# EAGLE board VLR_ENCoMAT (EAGLE 7.2.0)
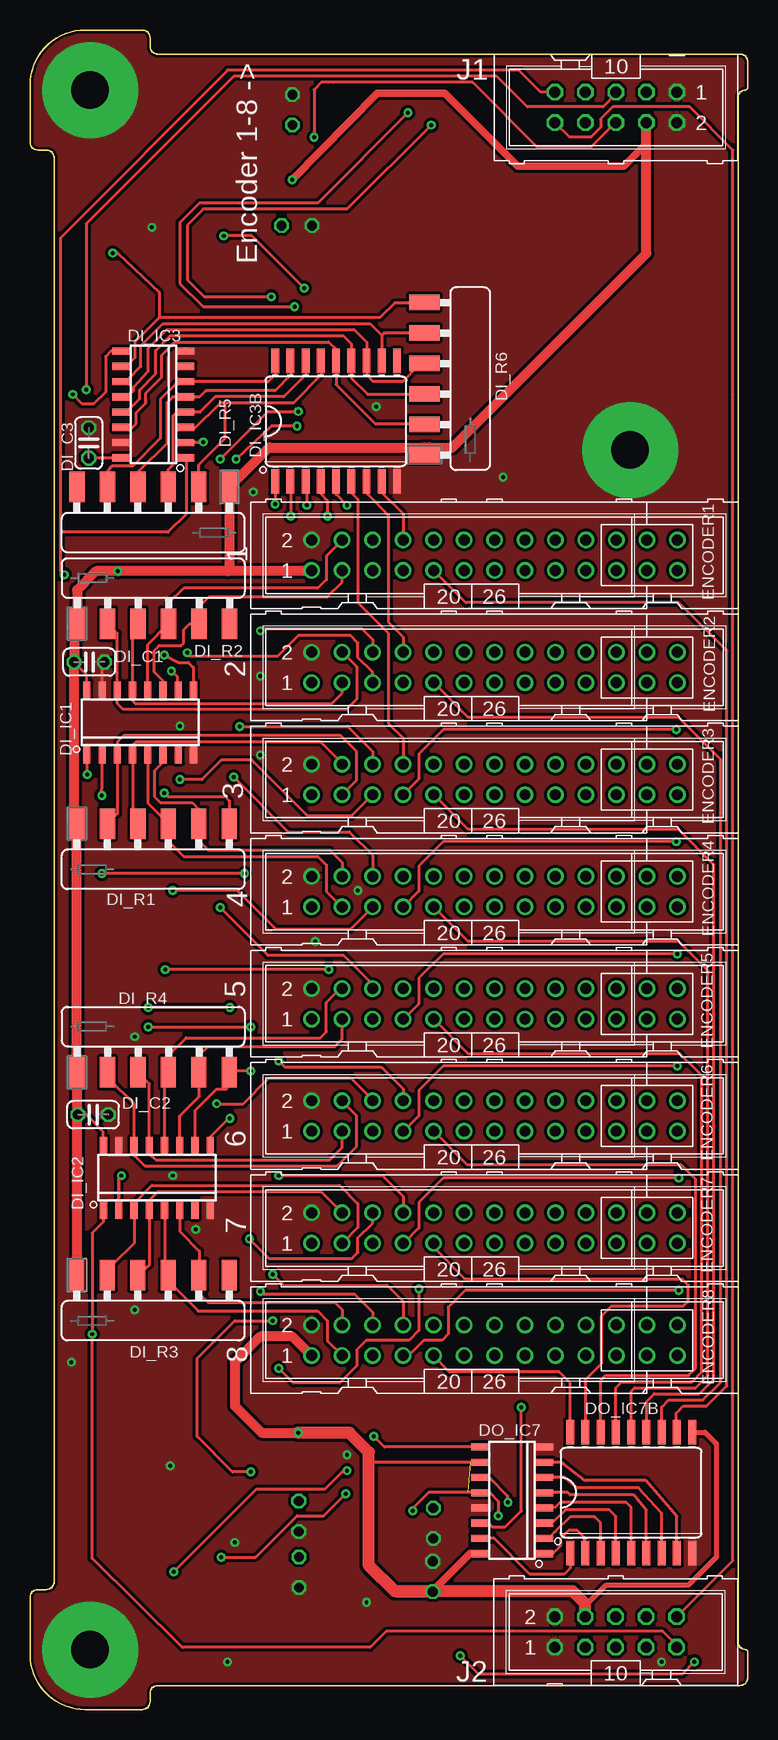
[diagram p2: board, top side]
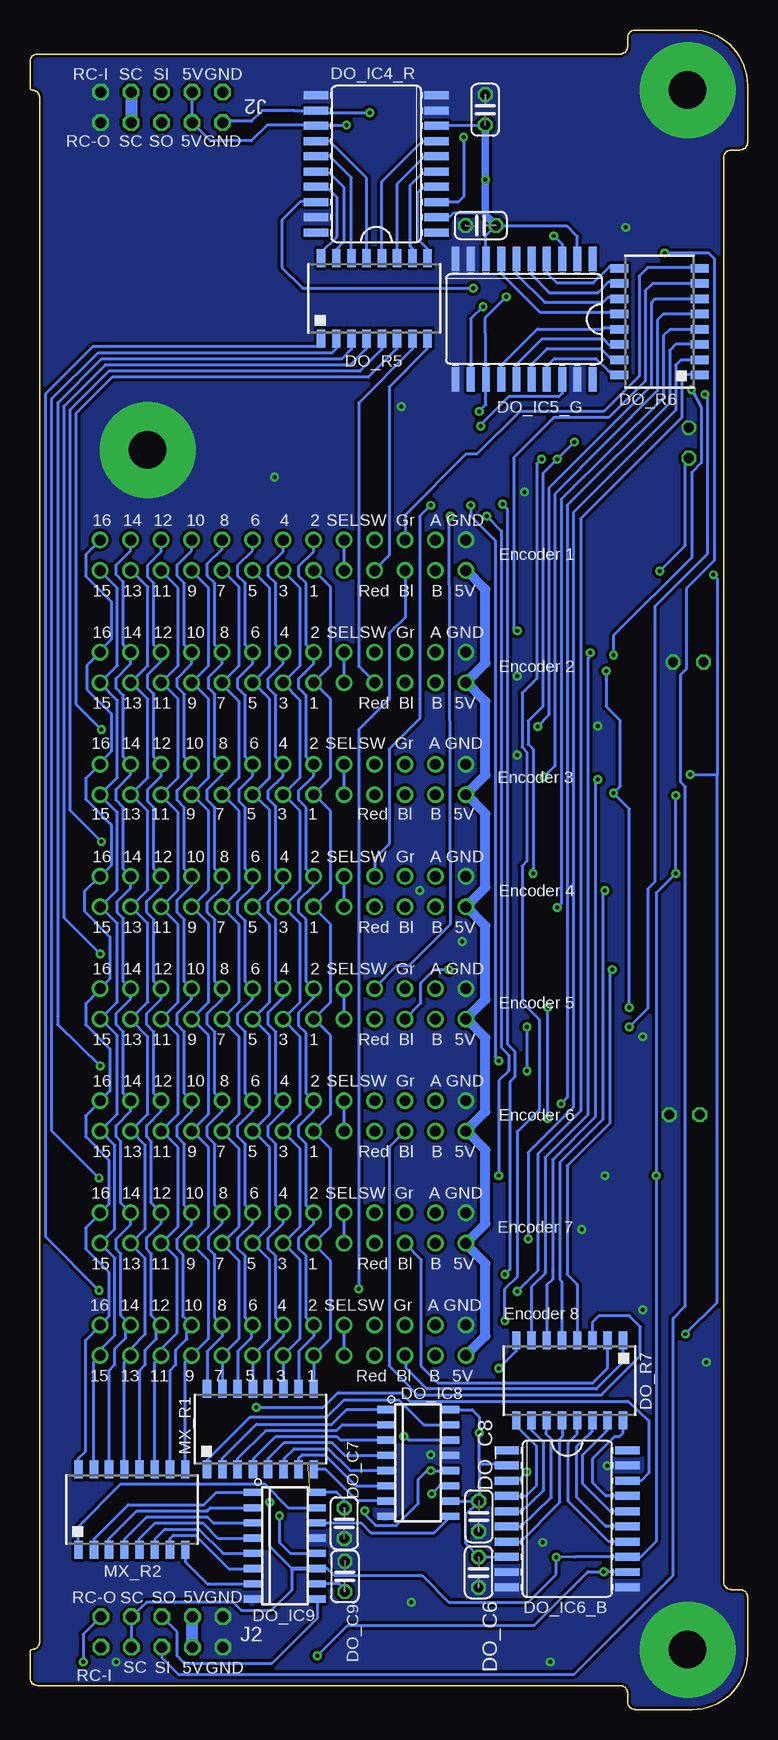
[diagram p3: board, bottom side, seen from below]

Size 59.8 x 140 mm. Coordinates in mm from the lower left corner, seen from the top.
Copper layers (1*16): Top 0.07mm / dielectric 1.6mm / Bottom 0.07mm
Design rules "001_MakePCB-8mil_min *": minimum track width 8mil, minimum drill 13mil, track to track 8mil, track to pad 8mil, pad to pad 8mil, via to via 8mil, smd to smd 8mil, copper to edge 8mil, drill to drill 8mil, minimum pad ring 8mil, minimum via ring 8mil, stop-mask expansion 2mil, vias tented up to drill 0mil, thermal gap 0mil
Net classes: 0 default: width 0.254 mm, drill 0.33 mm, clearance 0.254 mm; 1 VDD: width 0.406 mm, drill 0.33 mm, clearance 0.254 mm to class 0, clearance 0.254 mm

## Footprints (pad centres in the part's own frame; a part is rotated, then mirrored left to right if it is on the bottom)
C025-024X044 = drill 0.813 octagon: 1 -1.27,0; 2 1.27,0
SO16D = smd 0.6 x 1.4: 1 -4.481,-2.764; 2 -3.211,-2.764; 3 -1.941,-2.764; 4 -0.671,-2.764; 5 0.599,-2.764; 6 1.869,-2.764; 7 3.139,-2.764; 8 4.409,-2.764; 9 4.409,2.666; 10 3.139,2.666; 11 1.869,2.666; 12 0.599,2.666; 13 -0.671,2.666; 14 -1.941,2.666; 15 -3.211,2.666; 16 -4.481,2.666
SO18W = smd 0.66 x 2.032: 1 -5.08,-5.029; 2 -3.81,-5.029; 3 -2.54,-5.029; 4 -1.27,-5.029; 5 0,-5.029; 6 1.27,-5.029; 7 2.54,-5.029; 8 3.81,-5.029; 9 5.08,-5.029; 10 5.08,5.029; 11 3.81,5.029; 12 2.54,5.029; 13 1.27,5.029; 14 0,5.029; 15 -1.27,5.029; 16 -2.54,5.029; 17 -3.81,5.029; 18 -5.08,5.029
SIL6-SMD-R = smd 1.27 x 2.54: P$1 -6.35,0; P$2 -3.81,0; P$3 -1.27,0; P$4 1.27,0; P$5 3.81,0; P$6 6.35,0
SIL6-SMD = smd 1.27 x 2.54: P$1 -6.35,0; P$2 -3.81,0; P$3 -1.27,0; P$4 1.27,0; P$5 3.81,0; P$6 6.35,0
SO20W = smd 0.66 x 2.032: 1 -5.715,-5.029; 2 -4.445,-5.029; 3 -3.175,-5.029; 4 -1.905,-5.029; 5 -0.635,-5.029; 6 0.635,-5.029; 7 1.905,-5.029; 8 3.175,-5.029; 9 4.445,-5.029; 10 5.715,-5.029; 11 5.715,5.029; 12 4.445,5.029; 13 3.175,5.029; 14 1.905,5.029; 15 0.635,5.029; 16 -0.635,5.029; 17 -1.905,5.029; 18 -3.175,5.029; 19 -4.445,5.029; 20 -5.715,5.029
SOIC16W = smd 0.7 x 1.5: 1 -4.445,-3.346; 2 -3.175,-3.346; 3 -1.905,-3.346; 4 -0.635,-3.346; 5 0.635,-3.346; 6 1.905,-3.346; 7 3.175,-3.346; 8 4.445,-3.346; 9 4.445,3.346; 10 3.175,3.346; 11 1.905,3.346; 12 0.635,3.346; 13 -0.635,3.346; 14 -1.905,3.346; 15 -3.175,3.346; 16 -4.445,3.346
ML20-26COMBO = drill 0.914: 1 -15.24,-1.27; 2 -15.24,1.27; 3 -12.7,-1.27; 4 -12.7,1.27; 5 -10.16,-1.27; 6 -10.16,1.27; 7 -7.62,-1.27; 8 -7.62,1.27; 9 -5.08,-1.27; 10 -5.08,1.27; 11 -2.54,-1.27; 12 -2.54,1.27; 13 0,-1.27; 14 0,1.27; 15 2.54,-1.27; 16 2.54,1.27; 17 5.08,-1.27; 18 5.08,1.27; 19 7.62,-1.27; 20 7.62,1.27; 21 10.16,-1.27; 22 10.16,1.27; 23 12.7,-1.27; 24 12.7,1.27; 25 15.24,-1.27; 26 15.24,1.27
ML10 = drill 0.914 octagon: 1 -5.08,-1.27; 2 -5.08,1.27; 3 -2.54,-1.27; 4 -2.54,1.27; 5 0,-1.27; 6 0,1.27; 7 2.54,-1.27; 8 2.54,1.27; 9 5.08,-1.27; 10 5.08,1.27
MIDIBOX14X6 = drill 3.1 pad 8: P$1 5,135; P$2 50,105; P$4 5,5

## Placement (x,y rotation side)
DI_C1  100nF  [C025-024X044]  4.94,87.32 0 top
DI_C2  100nF  [C025-024X044]  5.26,49.58 0 top
DI_C3  100nF  [C025-024X044]  4.9,105.58 90 top
DI_IC1  74HC165N  [SO16D]  9.22,82.33 0 top
DI_IC2  74HC165N  [SO16D]  10.61,44.38 0 top
DI_IC3  74HC165N  [SO16D]  10.24,108.81 90 top
DI_IC3B  ULN2803  [SO18W]  25.5,107.39 0 top
DI_R1  10k  [SIL6-SMD-R]  10.26,73.84 180 top
DI_R2  10k  [SIL6-SMD]  10.27,90.51 0 top
DI_R3  10k  [SIL6-SMD-R]  10.26,36.22 180 top
DI_R4  10k  [SIL6-SMD]  10.26,53.12 0 top
DI_R5  10k  [SIL6-SMD]  10.26,101.91 180 top
DI_R6  10k  [SIL6-SMD-R]  32.87,110.94 270 top
DO_C4  100nF  [C025-024X044]  21.87,133.34 90 bottom
DO_C5  100nF  [C025-024X044]  22.24,123.7 180 bottom
DO_C6  100nF  [C025-024X044]  22.42,11.44 270 bottom
DO_C7  100n  [C025-024X044]  33.61,15.53 270 bottom
DO_C8  100n  [C025-024X044]  22.4,16.11 270 bottom
DO_C9  100n  [C025-024X044]  33.56,11.09 90 bottom
DO_IC4_R  TPIC6B595  [SO20W]  30.94,128.83 90 bottom
DO_IC5_G  TPIC6B595  [SO20W]  18.63,115.9 180 bottom
DO_IC6_B  TPIC6B595  [SO20W]  15.04,15.9 270 bottom
DO_IC7  74HC595  [SO16D]  40.13,17.48 90 top
DO_IC7B  ULN2803  [SO18W]  50.09,18.08 0 top
DO_IC8  74HC595  [SO16D]  27.41,20.52 270 bottom
DO_IC9  74HC595  [SO16D]  38.51,13.61 270 bottom
DO_R5  220  [SOIC16W]  31.11,117.63 0 bottom
DO_R6  220  [SOIC16W]  7.35,115.69 90 bottom
DO_R7  220  [SOIC16W]  14.83,27.43 180 bottom
ENCODER1  ML20-26COMBO  [ML20-26COMBO]  38.71,96.22 0 top
ENCODER2  ML20-26COMBO  [ML20-26COMBO]  38.71,86.87 0 top
ENCODER3  ML20-26COMBO  [ML20-26COMBO]  38.71,77.52 0 top
ENCODER4  ML20-26COMBO  [ML20-26COMBO]  38.71,68.17 0 top
ENCODER5  ML20-26COMBO  [ML20-26COMBO]  38.71,58.83 0 top
ENCODER6  ML20-26COMBO  [ML20-26COMBO]  38.71,49.48 0 top
ENCODER7  ML20-26COMBO  [ML20-26COMBO]  38.71,40.13 0 top
ENCODER8  ML20-26COMBO  [ML20-26COMBO]  38.71,30.78 0 top
J1  [ML10]  48.83,133.55 180 top
J2  [ML10]  48.81,6.46 0 top
MX_R1  220  [SOIC16W]  40.6,23.37 0 bottom
MX_R2  220  [SOIC16W]  51.31,16.66 0 bottom
U$2  MIDIBOX_HALF  [MIDIBOX14X6]  0,0 0 top
U$3  [ENCOMAT]  56.29,116.84 270 top
U$4  [VLRLAB]  40.44,127.51 270 top
U$5  [VLRLAB]  40.44,115.72 90 bottom

## Tracks (layer width: path | path; a pad name or v marks a point on that pad's centre or on a via)
+5V  (via drill 0.33)  (1 unrouted)
  Top 0.254: DO_IC7.10 37.46,20.62 36.68,20.62 28.24,20.62 | DI_IC1.16 4.74,86.25 DI_C1.1 | DI_IC3.16 4.87,104.33 DI_C3.1 | 36.79,12.99 DO_IC7.16 | DI_IC2.16 6.1,47.08 6.1,47.85 6.1,48.16 4.67,49.58 DI_C2.1
  Top 0.406: DO_IC7B.10 56.24,23.11 57.2,22.15 57.2,12.7 54.86,10.36 48,10.36 46.27,8.64
  Top 0.61: v21.84,127.51 28.96,134.72 34.54,134.72 40.64,128.63 49.48,128.63 51.37,130.51 J1.4 | 36.79,12.99 36.78,13.01 36.68,13.01 33.91,10.24 33.86,10.24 33.56,9.94 DO_C9.1
  Top 0.813: ENCODER1.1 23.47,94.89 16.46,94.89 | 16.46,94.89 v7.32,94.89 5.49,94.89 5.38,94.79 3.92,93.33 DI_R2.P$1 3.67,90.26 DI_C1.1 3.67,74.08 DI_R1.P$6 DI_R4.P$1 3.91,50.37 DI_C2.1 3.91,49.51 DI_R3.P$6 | ENCODER8.1 23.42,29.52 21.84,31.09 19.2,31.09 17.07,28.96 17.07,25.3 19.3,23.06 v22.35,23.06 | 16.46,94.89 16.61,95.05 DI_R5.P$1 19.9,105.2 | 19.9,105.2 32.87,105.21 DI_R6.P$6 32.91,104.55 32.92,104.85 33.27,105.21 35.2,105.21 | 19.9,105.2 20,105.21 35.2,105.21 | 35.2,105.21 51.37,121.37 J1.4
  Top 1.016: J2.4 46.27,8.64 46.27,8.8 45.21,9.86 30.38,9.86 | 30.38,9.86 28.24,11.99 28.24,20.62 28.24,21.44 26.62,23.06 v22.35,23.06 | 30.38,9.86 33.53,9.86 DO_C9.1
  Bottom 0.254: 4.9,104.32 5.18,103.83 5.18,97.03 v7.32,94.89 | DO_IC4_R.8 25.84,132.07 DO_C4.1 | DO_IC5_G.8 21.8,122.86 DO_C5.1 20.92,123.65 15.04,123.65 14.18,122.79 DO_IC5_G.2 | DO_IC4_R.2 25.84,124.46 24.79,124.46 24.49,124.77 21.87,124.77 | DO_IC8.10 23.67,17.37 23.37,17.37 DO_C8.1 | DO_C8.1 22.4,17.33 23.47,16.26 23.47,13.84 DO_C6.1 22.61,12.73 DO_IC6_B.8 | DO_IC6_B.2 20.14,20.42 | 20.14,20.42 22.35,20.42 | 22.35,20.42 22.35,18.49 22.36,17.78 DO_C8.1 | DO_C9.1 34.03,10.47 DO_IC9.10 | 36.47,18.09 DO_IC9.16 34.25,18.09 33.63,17.48 33.61,17.46 DO_C7.1 | 20.14,20.42 22.35,20.42 | 22.35,20.42 22.35,20.83 v22.35,23.06 22.35,24.38 22.96,24.99 23.98,24.99 DO_IC8.16
  Bottom 0.33: DI_C3.1 4.9,104.32
  Bottom 0.61: DO_C4.1 21.87,124.77 21.87,124.6 DO_C5.1 21.84,124.58 v21.84,127.51
  Bottom 0.813: ENCODER8.1 21.84,31.14 21.84,37.19 23.47,38.81 ENCODER7.1 21.84,40.49 21.84,46.63 23.42,48.21 ENCODER6.1 21.84,49.84 21.84,55.98 23.42,57.56 ENCODER5.1 21.84,59.18 21.84,65.33 23.42,66.9 ENCODER4.1 21.84,68.53 21.84,74.68 23.42,76.25 ENCODER3.1 21.84,77.88 21.84,84.02 23.42,85.6 ENCODER2.1 21.84,87.22 21.84,93.37 23.42,94.94 ENCODER1.1
  Bottom 1.016: J1.3 J1.4 | J2.3 J2.4
DI_IC3_SW1
  Top 0.254: DI_IC3.11 7.63,110.64 8.23,110.95 9.25,111.96 9.25,113.69 11.07,115.52 28.35,115.52 29.31,114.55 | 29.31,114.55 DI_IC3B.11 | DI_R6.P$2 29.51,114.75 29.31,114.55
DI_IC3_SW2
  Top 0.254: DI_IC3.12 8.33,109.63 8.61,109.91 8.61,110 8.64,110.25 9.86,111.57 9.86,113.49 11.38,115.01 27.03,115.01 28.04,113.99 DI_IC3B.12 28.04,111.25 28.55,110.74 31.09,110.74 32.31,111.96 32.62,111.96 DI_R6.P$3
DI_IC3_SW3
  Top 0.254: DI_IC3.13 7.77,108.1 8.18,108.31 9.14,109.27 9.14,109.98 10.46,111.35 10.46,113.28 11.68,114.5 26.11,114.5 26.77,113.84 DI_IC3B.13 26.77,111 28.14,109.63 32.83,109.63 DI_R6.P$4
DI_IC3_SW4
  Top 0.254: DI_IC3.14 8.52,106.87 8.84,107.19 8.84,108.1 9.65,108.92 9.65,109.12 9.65,109.73 10.97,111.05 10.97,111.25 10.97,112.88 11.79,113.69 12.09,114 24.89,114 25.5,113.39 DI_IC3B.14 25.5,110.44 28.75,107.19 32.81,107.19 DI_R6.P$5
DI_IC3_SW5
  Top 0.254: DI_IC3B.15 24.28,112.37 24.28,111.25 21.95,108.92 16.26,108.92 | 16.26,108.92 15.85,108.92 13.6,106.67 DI_IC3.3 | DI_R5.P$2 14.07,103.78 16.26,105.97 16.26,108.92
DI_IC3_SW6
  Top 0.254: DI_IC3B.16 22.96,111.25 21.13,109.42 15.44,109.42 14.16,108.14 DI_IC3.4 12.23,108.14 11.89,107.8 11.89,103.73 11.48,103.33 11.48,101.86 DI_R5.P$3
DI_IC3_SW7
  Top 0.254: DI_IC3B.17 21.74,112.37 21.74,111.25 20.42,109.93 14.73,109.93 14.63,109.93 14.11,109.41 DI_IC3.5 11.88,109.41 11.38,108.92 11.38,105.51 9.04,103.23 9.04,101.96 DI_R5.P$4
DI_IC3_SW8
  Top 0.254: DI_IC3B.18 20.42,111.25 19.85,110.68 DI_IC3.6 12.13,110.48 10.87,109.22 10.87,105.97 8.55,103.64 6.82,103.64 6.4,103.12 6.4,102.16 DI_R5.P$5
DI_IC4_SER_OUT2  (via drill 0.33)
  Top 0.254: DI_IC1.10 12.29,86.05 v11.79,86.56 | v11.18,76.4 11.48,76.1 16.26,76.1 16.61,75.74 DI_R1.P$1 | DI_IC2.9 15.02,47.74 16.36,49.07 v16.66,49.28 | v16.66,58.52 v9.86,58.52
  Bottom 0.254: v11.79,86.56 11.79,85.85 11.79,83.62 10.67,82.5 10.67,76.91 v11.18,76.4 9.86,75.08 v9.86,58.52 | v16.66,49.28 v16.66,58.52
DI_IC5_SER_OUT2  (via drill 0.33)
  Top 0.254: DI_IC2.10 13.75,49.92 15.54,51.71 16.36,51.71 16.66,52.02 16.66,53.06 DI_R4.P$6 16.73,53.24 v18.39,53.24 | DI_IC3.9 6.75,113.22 6.3,112.78 6.3,109.83 5.28,108.81 4.37,108.81 v3.56,109.63 | v9.86,56.9 v18.39,56.9
  Bottom 0.254: v3.56,109.63 3.56,109.53 3.35,109.32 3.35,96.32 6.6,93.07 7.72,91.95 7.72,68.99 8.33,68.38 8.33,58.42 v9.86,56.9 | v18.39,56.9 v18.39,53.24
DO_IC4_R_QA
  Bottom 0.254: DO_R5.9 26.66,121.74 27.5,122.58 27.5,126.44 27.1,126.85 25.99,126.85 DO_IC4_R.4
DO_IC4_R_QB
  Bottom 0.254: DO_R5.10 27.93,121.79 28.11,121.97 28.11,127.05 27.1,128.07 26.04,128.07 DO_IC4_R.5
DO_IC4_R_QC
  Bottom 0.254: DO_R5.11 29.2,127.18 26.89,129.49 25.93,129.49 DO_IC4_R.6
DO_IC4_R_QD
  Bottom 0.254: DO_R5.12 30.47,127.33 27.1,130.71 25.94,130.71 DO_IC4_R.7
DO_IC4_R_QE
  Bottom 0.254: DO_R5.13 31.74,127.63 34.82,130.71 35.94,130.71 DO_IC4_R.14
DO_IC4_R_QF
  Bottom 0.254: DO_R5.14 33.01,127.68 34.82,129.49 35.95,129.49 DO_IC4_R.15
DO_IC4_R_QG
  Bottom 0.254: DO_R5.15 34.28,121.69 33.6,122.38 33.6,126.85 34.82,128.07 35.84,128.07 DO_IC4_R.16
DO_IC4_R_QH
  Bottom 0.254: DO_R5.16 35.55,121.44 34.21,122.78 34.21,126.03 35.02,126.85 35.89,126.85 DO_IC4_R.17
DO_IC4_R_SEROUT  (via drill 0.33)
  Top 0.254: v22.86,118.47 18.49,122.83 v16.15,122.83
  Bottom 0.254: DO_IC4_R.18 35.99,125.68 37.29,125.68 38.81,124.16 38.81,120.19 37.08,118.47 v22.86,118.47 | v16.15,122.83 15.45,122.13 DO_IC5_G.3
DO_IC5_G_QA
  Bottom 0.254: DO_IC5_G.4 16.72,119.75 15.9,118.92 12.85,118.92 11.5,120.28 10.96,120.28 DO_R6.9
DO_IC5_G_QB
  Bottom 0.254: DO_IC5_G.5 17.99,119.59 16.51,118.11 12.45,118.11 11.55,119 10.76,119 DO_R6.10
DO_IC5_G_QC
  Bottom 0.254: DO_IC5_G.6 19.26,119.64 16.92,117.3 12.04,117.3 11.6,117.73 10.96,117.73 DO_R6.11
DO_IC5_G_QD
  Bottom 0.254: DO_IC5_G.7 20.53,119.69 17.32,116.49 11.08,116.49 11.1,116.31 DO_R6.12
DO_IC5_G_QE
  Bottom 0.254: DO_IC5_G.14 20.53,112.06 17.53,115.06 12.04,115.06 11.91,115.19 10.76,115.19 DO_R6.13
DO_IC5_G_QF
  Bottom 0.254: DO_IC5_G.15 19.26,112.11 17.12,114.25 12.04,114.25 | 11.82,114.03 11.57,113.78 DO_R6.14 | 11.82,114.03 12.04,114.25 | 11.82,114.03 12.04,114.25
DO_IC5_G_QG
  Bottom 0.254: DO_IC5_G.16 17.99,112.16 16.71,113.44 12.24,113.44 | 11.56,112.76 11.32,112.51 DO_R6.15 | 11.56,112.76 12.24,113.44 | 11.56,112.76 12.24,113.44
DO_IC5_G_QH
  Bottom 0.254: DO_IC5_G.17 16.71,111.08 16.71,112.02 16.1,112.62 12.65,112.62 11.63,111.61 | DO_R6.16 11.27,111.24 11.61,111.59 11.63,111.61 | 11.63,111.61
DO_IC5_G_SEROUT  (via drill 0.33)
  Top 0.254: v22.25,106.98 20.12,106.98 v17.17,104.24 | v18.39,19.81 16.87,19.81 13.92,22.76 13.92,29.26 17.07,32.41 v20.22,32.41
  Bottom 0.254: DO_IC5_G.18 15.44,110.86 15.44,109.73 15.75,109.42 19.91,109.42 22.25,107.09 v22.25,106.98 | DO_IC6_B.3 20.04,19.1 19.1,19.1 v18.39,19.81 | v17.17,104.24 17.58,103.83 17.58,85.95 18.8,84.73 18.8,80.21 18.39,79.81 18.39,70.71 18.8,70.31 18.8,58.93 17.37,57.51 17.37,49.99 19.2,48.16 19.2,36.07 20.22,35.05 v20.22,32.41
DO_IC6_B_QA
  Bottom 0.254: DO_IC6_B.4 18.47,17.81 17.58,18.69 17.58,21.95 19.31,23.67 19.31,23.55 19.28,23.58 DO_R7.9
DO_IC6_B_QB
  Bottom 0.254: DO_IC6_B.5 18.82,16.54 16.97,18.29 16.97,22.25 18.03,23.32 18.03,23.35 18.01,23.57 DO_R7.10
DO_IC6_B_QC
  Bottom 0.254: DO_IC6_B.6 18.87,15.27 16.36,17.68 16.36,22.55 16.77,22.94 16.74,23.47 DO_R7.11
DO_IC6_B_QD
  Bottom 0.254: DO_IC6_B.7 18.92,14 15.65,17.27 15.65,22.53 15.39,22.87 15.4,23.07 15.37,23.51 DO_R7.12
DO_IC6_B_QE
  Bottom 0.254: DO_IC6_B.14 11.56,14 14.94,17.37 14.94,22.23 14.85,22.33 14.33,22.84 14.2,22.97 DO_R7.13
DO_IC6_B_QF
  Bottom 0.254: DO_IC6_B.15 11.81,15.27 14.23,17.68 14.23,21.95 13.62,22.55 13.21,22.94 12.93,23.22 DO_R7.14
DO_IC6_B_QG
  Bottom 0.254: DO_IC6_B.16 11.46,16.54 13.72,18.8 13.72,21.23 12.19,22.76 11.79,23.19 11.66,23.32 DO_R7.15
DO_IC6_B_QH
  Bottom 0.254: DO_IC6_B.17 11.81,17.81 12.9,18.9 12.9,20.93 11.07,22.76 10.67,22.76 10.36,23.06 10.36,24.06 DO_R7.16
DO_IC6_B_SEROUT  (via drill 0.33)
  Top 0.254: DO_IC7.14 37.48,15.54 38.2,15.54 38.51,15.24 39.62,15.24 40.94,16.56 v40.94,25.2
  Bottom 0.254: v40.94,25.2 40.84,25.2 35.36,25.2 34.14,26.42 28.85,26.42 28.14,25.7 9.96,25.7 8.23,24.08 8.23,19.71 8.86,19.08 DO_IC6_B.18
DO_IC7_QA
  Top 0.254: DO_IC7B.1 45.01,11.79 44.5,11.28 44.45,11.28 41.66,11.28 38.67,14.26 DO_IC7.15
DO_IC7_QB
  Top 0.254: DO_IC7B.2 46.23,13.11 46.23,14.33 45.62,14.94 44.91,14.94 44.2,14.22 44.2,14.02 44.2,13.61 43.58,12.99 DO_IC7.1
DO_IC7_QC
  Top 0.254: DO_IC7B.3 47.55,15.54 47.04,16.05 45.01,16.05 43.79,14.83 43.22,14.26 DO_IC7.2
DO_IC7_QD
  Top 0.254: DO_IC7B.4 48.82,16.1 48.26,16.66 44.63,16.66 43.59,15.65 43.01,15.65 DO_IC7.3
DO_IC7_QE
  Top 0.254: DO_IC7B.5 50.09,16.87 49.68,17.27 44.2,17.27 43.79,16.87 42.84,16.8 DO_IC7.4
DO_IC7_QF
  Top 0.254: DO_IC7B.6 51.36,16.61 50.29,17.88 45.01,17.88 44.81,18.09 43.11,18.09 DO_IC7.5
DO_IC7_QG
  Top 0.254: DO_IC7B.7 52.63,16.36 50.7,18.49 45.62,18.49 44.6,19.3 44.56,19.34 DO_IC7.6
DO_IC7_QH
  Top 0.254: DO_IC7B.8 53.9,16.1 51.31,19.1 46.23,19.1 44.4,20.52 44.31,20.61 DO_IC7.7
DO_IC7_SEROUT  (via drill 0.33)
  Top 0.254: DO_IC7.9 29.53,21.88 v28.65,22.76
  Bottom 0.254: v28.65,22.76 28.25,22.46 DO_IC8.14
DO_IC8_ROW1
  Bottom 0.254: DO_IC8.7 32.52,17.38 35.15,20.02 MX_R1.8
DO_IC8_ROW2
  Bottom 0.254: MX_R1.7 37.42,20.9 37.39,20.93 37.08,21.23 35.26,21.23 32.67,18.65 DO_IC8.6
DO_IC8_ROW3
  Bottom 0.254: MX_R1.6 38.61,20.11 38.61,20.93 37.8,21.74 35.05,21.74 34.95,21.74 33.13,19.92 DO_IC8.5
DO_IC8_ROW4
  Bottom 0.254: MX_R1.5 39.93,20.05 39.93,20.93 38.61,22.25 34.65,22.25 33.59,21.19 DO_IC8.4
DO_IC8_ROW5
  Bottom 0.254: MX_R1.4 41.15,20.11 41.15,20.93 39.32,22.76 34.24,22.76 33.94,22.46 DO_IC8.3
DO_IC8_ROW6
  Bottom 0.254: MX_R1.3 42.47,20.05 42.47,20.93 40.13,23.27 34.24,23.27 33.77,23.73 DO_IC8.2
DO_IC8_ROW7
  Bottom 0.254: MX_R1.2 43.79,20.04 43.79,20.93 40.94,23.77 34.65,23.77 33.42,25 DO_IC8.1
DO_IC8_ROW8
  Bottom 0.254: MX_R1.1 45.01,20.05 45.01,20.83 41.45,24.38 35.05,24.38 33.63,25.81 29.06,25.81 26.98,23.73 DO_IC8.15
DO_IC8_SEROUT
  Bottom 0.254: DO_IC9.14 35.83,15.54 32.21,15.54 31.39,14.73 26.11,14.73 24.75,16.1 DO_IC8.9
DO_IC9_ROW1
  Bottom 0.254: MX_R2.8 46.86,12.32 45.01,10.46 42.78,10.47 42.77,10.46 DO_IC9.7
DO_IC9_ROW2
  Bottom 0.254: MX_R2.7 48.13,14.2 48.16,14.22 47.85,14.53 46.02,14.53 43.24,11.74 DO_IC9.6
DO_IC9_ROW3
  Bottom 0.254: MX_R2.6 49.38,13.34 49.38,14.22 48.56,15.04 45.72,15.04 43.7,13.01 DO_IC9.5
DO_IC9_ROW4
  Bottom 0.254: MX_R2.5 50.7,13.34 50.7,14.22 49.38,15.54 45.42,15.54 44.15,14.28 DO_IC9.4
DO_IC9_ROW5
  Bottom 0.254: MX_R2.4 51.92,13.34 51.92,14.22 50.09,16.05 45.01,16.05 44.51,15.55 DO_IC9.3
DO_IC9_ROW6
  Bottom 0.254: MX_R2.3 53.24,13.34 53.24,14.22 50.9,16.56 45.01,16.56 44.75,16.82 DO_IC9.2
DO_IC9_ROW7
  Bottom 0.254: MX_R2.2 54.46,13.34 54.46,14.22 51.61,17.07 45.31,17.07 44.29,18.09 DO_IC9.1
DO_IC9_ROW8
  Bottom 0.254: MX_R2.1 55.78,13.34 55.78,15.24 52.22,18.8 40.23,18.8 38.26,16.82 DO_IC9.15
GND  (via drill 0.33)
  Top 0.254: DI_IC1.15 6.01,86.93 DI_C1.2
  other vias: 52.63,3.96 26.42,21.23 11.68,20.32 16.46,3.96 28.04,8.94 17.07,13.92 3.45,28.96 8.74,33.32 8.74,56.08 11.89,44.5 13.82,40.03 27.33,68.28 23.77,64.01 12.5,81.99 19.2,86.16 19.2,79.55 28.85,108.61 18.59,101.5 39.42,102.72 10.16,123.55
  pour Bottom: 64.62,-2.95 -3.05,-2.95 -3.05,140.41 64.62,140.41
  pour Top: 64.11,-2.44 -3.56,-2.44 -4.06,140.72 64.11,140.92
MATRIXROT1
  Top 0.254: DO_IC7B.11 53.85,23.17 53.85,24.69 54.46,25.3 56.39,25.3 58.06,26.98 58.06,35.23 58.06,88.24 57.96,88.34 54.05,92.25 36.32,92.25 ENCODER1.9
  Bottom 0.254: ENCODER1.9 ENCODER1.10
MATRIXROT2
  Top 0.254: DO_IC7B.12 52.63,25.2 53.24,25.81 56.08,25.81 57.56,27.28 57.56,35.26 57.56,79.2 54.23,82.53 | ENCODER2.9 36.53,82.7 54.05,82.7 54.23,82.53 | 57.45,79.3 54.23,82.53
  Bottom 0.254: ENCODER2.9 ENCODER2.10
MATRIXROT3
  Top 0.254: DO_IC7B.13 51.41,23.16 51.41,25.7 52.02,26.31 55.68,26.31 55.78,26.31 57,27.53 57,35.15 57,70.41 54.05,73.36 36.53,73.36 ENCODER3.9
  Bottom 0.254: ENCODER3.9 ENCODER3.10
MATRIXROT4
  Top 0.254: DO_IC7B.14 50.09,26.52 50.39,26.82 55.47,26.82 56.49,27.84 56.49,35.26 56.49,61.57 | ENCODER4.9 36.53,64.01 54.05,64.01 56.39,61.67 | 56.49,61.57 56.39,61.67 | 56.49,61.57 56.39,61.67
  Bottom 0.254: ENCODER4.9 ENCODER4.10
MATRIXROT5
  Top 0.254: DO_IC7B.15 48.82,26.82 49.33,27.33 55.07,27.33 55.17,27.33 55.98,28.14 55.98,35.15 55.98,52.83 | ENCODER5.9 36.53,54.66 54.15,54.66 55.63,53.19 | 55.98,52.83 55.63,53.19 | 55.98,52.83 55.63,53.19
  Bottom 0.254: ENCODER5.9 ENCODER5.10
MATRIXROT6
  Top 0.254: DO_IC7B.16 47.55,27.43 47.96,27.84 54.86,27.84 55.47,28.45 55.47,35.2 55.47,44.2 54.25,45.41 36.42,45.41 ENCODER6.9
  Bottom 0.254: ENCODER6.9 ENCODER6.10
MATRIXROT7
  Top 0.254: DO_IC7B.17 46.33,23.16 46.33,24.08 46.33,27.53 47.14,28.35 47.65,28.85 47.65,32.72 47.65,32.82 48.46,33.63 54.46,33.63 54.86,34.04 54.86,35.36 54.36,35.87 36.27,35.87 33.63,38.51 ENCODER7.9
  Bottom 0.254: ENCODER7.9 ENCODER7.10
MATRIXROT8
  Top 0.254: DO_IC7B.18 45.01,24.08 45.01,27.23 44.09,28.14 34.95,28.14 33.63,29.46 ENCODER8.9
  Bottom 0.254: ENCODER8.9 ENCODER8.10
R1B  (via drill 0.33)
  Top 0.254: v32.41,35.05 32.41,31.6 31.6,30.79 28.04,30.79 27.23,29.97 27.23,28.65 25.81,27.23 21.95,27.23 v20.73,28.45
  Bottom 0.254: ENCODER1.5 28.55,91.03 29.87,89.71 29.87,84.23 32.41,81.69 v32.41,35.05 | v20.73,28.45 19.28,29.9 DO_R7.8
R1G
  Bottom 0.254: DO_R6.8 4.06,120.19 8.33,120.19 9.04,119.48 9.04,111.15 11.99,108.2 19,108.2 22.56,104.65 23.47,104.65 28.55,99.57 ENCODER1.6
R1R
  Bottom 0.254: DO_R5.8 26.72,114.23 26.72,113.39 29.87,110.24 29.87,96.22 31.09,95 ENCODER1.7
R2B  (via drill 0.33)
  Top 0.254: ENCODER2.5 28.55,86.46 27.33,87.68 27.33,88.9 26.72,89.51 22.35,89.51 20.62,87.78 13.41,87.78 v13.11,88.09
  Bottom 0.254: v13.11,88.09 13.31,87.58 13.31,49.78 13.31,49.58 16.87,46.02 16.87,36.58 16.87,36.47 16.87,36.37 18.01,35.23 DO_R7.7
R2G  (via drill 0.33)
  Top 0.254: v19.2,89.92 19.51,90.12 27.64,90.12 28.55,89.2 ENCODER2.6
  Bottom 0.254: DO_R6.7 4.01,118.87 7.92,118.87 8.53,118.26 8.53,110.74 11.58,107.7 16.15,107.7 19.51,104.34 19.51,90.12 v19.2,89.92
R2R
  Bottom 0.254: DO_R5.7 27.94,113.39 32.41,108.92 32.41,86.97 31.09,85.65 ENCODER2.7
R3B  (via drill 0.33)
  Top 0.254: ENCODER3.5 26.77,74.47 23.16,74.47 18.49,79.15 15.95,79.15 14.33,77.52 v12.5,77.52
  Bottom 0.254: v12.5,77.52 12.7,77.72 12.7,49.38 16.26,45.82 16.26,36.58 16.26,35.87 16.74,35.38 DO_R7.6
R3G  (via drill 0.33)
  Top 0.254: v17.48,81.94 26.47,81.94 28.55,79.86 ENCODER3.6
  Bottom 0.254: DO_R6.6 4.04,117.55 7.72,117.55 8.03,117.25 8.03,110.34 16.56,101.8 16.56,82.91 v17.48,81.94
R3R  (via drill 0.33)
  Top 0.254: 31.14,76.25 ENCODER3.7 32.41,77.57 32.41,79.65 34.44,81.69 v53.85,81.69
  Bottom 0.254: DO_R5.6 29.26,114.23 29.26,113.39 31.6,111.05 52.93,111.05 55.98,108 55.98,83.82 v53.85,81.69
R4B  (via drill 0.33)
  Top 0.254: ENCODER4.5 26.67,65.02 20.52,65.02 17.27,68.28 v11.89,68.28
  Bottom 0.254: v11.89,68.28 12.09,68.38 12.09,49.17 15.65,45.62 15.65,36.58 15.65,35.87 15.47,35.69 DO_R7.5
R4G  (via drill 0.33)
  Top 0.254: v16.97,77.72 21.54,73.15 26.62,73.15 28.55,71.22 ENCODER4.6
  Bottom 0.254: DO_R6.5 4.01,116.33 7.01,116.33 7.52,115.82 7.52,109.93 16.05,101.3 16.05,78.64 v16.97,77.72
R4R  (via drill 0.33)
  Top 0.254: v53.85,72.34 34.44,72.34 32.41,70.31 32.41,68.22 ENCODER4.7
  Bottom 0.254: DO_R5.5 30.47,113.39 30.48,113.39 32.31,111.56 53.24,111.56 56.49,108.31 56.49,74.98 v53.85,72.34
R5B  (via drill 0.33)
  Top 0.254: v24.89,61.67 v11.28,61.67
  Bottom 0.254: ENCODER5.5 27.23,58.88 27.23,60.55 26.11,61.67 v24.89,61.67 | v11.28,61.67 11.48,61.47 11.48,48.87 15.04,45.31 15.04,36.27 14.2,35.43 DO_R7.4
R5G  (via drill 0.33)
  Top 0.254: v15.85,66.85 19.81,62.89 26.11,62.89 28.55,60.45 ENCODER5.6
  Bottom 0.254: DO_R6.4 4.04,115.01 6.5,115.01 7.01,114.5 7.01,109.32 15.54,100.89 15.54,67.16 v15.85,66.85
R5R  (via drill 0.33)
  Top 0.254: v53.95,62.99 53.75,62.99 34.44,62.99 32.41,60.96 32.41,58.83 31.14,57.56 ENCODER5.7
  Bottom 0.254: DO_R5.4 31.74,113.44 31.8,113.39 33.12,112.06 53.54,112.06 57,108.61 57,66.04 v53.95,62.99
R6B
  Bottom 0.254: ENCODER6.5 29.87,46.89 29.87,28.65 27.53,26.21 12.19,26.21 8.94,29.46 8.94,31.9 9.86,32.82 12.4,32.82 12.93,32.28 DO_R7.3
R6G  (via drill 0.33)
  Top 0.254: v15.54,50.49 17.78,50.49 19.91,52.63 26.72,52.63 28.55,50.8 ENCODER6.6
  Bottom 0.254: DO_R6.3 4.01,113.79 5.99,113.79 6.5,113.28 6.5,108.92 15.04,100.38 15.04,51 v15.54,50.49
R6R  (via drill 0.33)
  Top 0.254: v53.95,53.65 53.64,53.65 34.44,53.65 32.41,51.61 32.41,49.48 31.14,48.21 ENCODER6.7
  Bottom 0.254: DO_R5.3 33.01,113.39 33.02,113.39 33.83,112.57 53.85,112.57 57.51,108.92 57.51,57.81 57.51,57.1 v53.95,53.65
R7B
  Bottom 0.254: ENCODER7.5 27.23,37.54 27.23,28.65 25.81,27.23 12.9,27.23 11.66,28.47 DO_R7.2
R7G  (via drill 0.33)
  Top 0.254: v18.29,39.22 19.91,37.59 26.82,37.59 27.33,38.1 27.33,39.32 28.55,40.54 ENCODER7.6
  Bottom 0.254: DO_R6.2 4.04,112.47 5.59,112.47 5.99,112.06 5.99,108.31 14.53,99.77 14.53,50.19 18.29,46.43 v18.29,39.22
R7R  (via drill 0.33)
  Top 0.254: v54.05,44.3 34.44,44.3 32.41,42.27 32.41,40.13 31.14,38.86 ENCODER7.7
  Bottom 0.254: DO_R5.2 34.28,113.44 34.34,113.39 34.65,113.08 54.15,113.08 58.01,109.22 58.01,48.26 v54.05,44.3
R8B
  Bottom 0.254: DO_R7.1 10.39,28.93 12.6,26.72 26.72,26.72 28.45,28.45 28.45,29.41 ENCODER8.5
R8G  (via drill 0.33)
  Top 0.254: v19.2,34.85 19.41,34.65 27.03,34.65 28.55,33.12 ENCODER8.6
  Bottom 0.254: DO_R6.1 4.01,111.25 5.18,111.25 5.38,111.05 5.49,110.95 5.49,107.7 13.92,99.26 13.92,49.89 17.48,46.33 17.48,38.41 17.48,36.58 v19.2,34.85
R8R  (via drill 0.33)
  Top 0.254: v54.05,34.95 36.27,34.95 34.85,33.53 34.85,31.29 34.34,30.79 32.82,30.79 31.55,29.52 ENCODER8.7
  Bottom 0.254: DO_R5.1 35.54,113.59 54.56,113.59 58.52,109.63 58.52,39.42 v54.05,34.95
RC-I  (via drill 0.33)
  Top 0.254: DI_IC1.1 4.74,78.06 v4.78,77.93 | 2.54,98.15 2.54,122.63 16.46,136.65 40.74,136.65 42.57,134.82 J1.9 | DI_IC3.1 13,99.67 11.48,98.15 2.54,98.15 | 6.1,41.65 DI_IC2.1 6.1,41.58 6.1,40.64 5.18,39.73 v5.18,31.29 5.18,12.6 12.7,5.18 28.35,5.18 29.67,6.5 52.73,6.5 53.89,5.34 J2.9 | 2.54,98.15 2.54,94.89 v2.84,94.59
  Bottom 0.254: v2.84,94.59 2.54,94.28 2.54,77.93 | v4.78,77.93 2.54,77.93 | v5.18,31.29 2.54,33.93 2.54,77.93
RC-O  (via drill 0.33)
  Top 0.254: v31.5,133.1 23.98,125.58 17.48,125.58 14.12,125.58 12.5,123.95 12.5,118.87 14.43,116.94 v22.05,116.94 | v26.42,19.91 26.11,19.91 24.59,18.39 18.9,18.39 v11.99,11.48 11.99,11.28 | J2.10 58.57,12.41 58.57,109.63 58.57,130 54.97,133.6 48.56,133.6 47.55,132.59 47.55,131.88 46.74,131.06 44.96,131.06 J1.10 | v39.01,16.15 39.01,17.37 38.3,18.09 37.48,18.09 DO_IC7.12 37.46,18.09 36.58,18.09 33.22,18.09 31.9,16.76 v31.9,16.56 | v55.37,3.96 54.36,2.95 37.39,2.95 v35.86,4.47
  Bottom 0.254: v31.5,133.1 35.84,133.1 DO_IC4_R.12 37.77,133.28 40.46,133.28 41.35,132.38 43.64,132.38 J1.10 | v22.05,116.94 23.07,115.92 DO_IC5_G.12 | DO_IC6_B.12 11.05,11.46 11.07,11.48 v11.99,11.48 13.31,11.48 17.78,7.01 33.32,7.01 v35.86,4.47 | DO_IC8.12 v26.42,19.91 26.72,19.91 27.43,19.2 27.43,17.17 29.26,15.34 30.99,15.34 31.9,16.26 v31.9,16.56 | DO_IC9.12 38.11,13.01 39.01,13.92 v39.01,16.15 | J2.10 55.37,6.25 v55.37,3.96
ROT1A
  Top 0.254: DI_IC1.12 9.82,88.79 DI_R2.P$4 11.54,92.21 12.8,93.47 23.98,93.47 24.69,94.18 24.69,96.16 ENCODER1.4
ROT1B
  Top 0.254: ENCODER1.3 26.01,93.98 24.79,92.76 14.94,92.76 14.12,91.95 14.12,90.55 DI_R2.P$5 13.3,90.51 12.8,90.02 12.8,88.9 12.6,88.7 10.77,88.7 10.36,88.29 10.36,86.46 11.07,85.75 DI_IC1.11
ROT2A
  Top 0.254: DI_R2.P$2 7.28,89.69 DI_IC1.14 7.28,83.86 7.77,83.36 26.37,83.36 27.23,84.23 27.23,86.92 ENCODER2.4
ROT2B
  Top 0.254: DI_R2.P$3 8.55,90.06 DI_IC1.13 8.53,84.98 8.53,84.12 8.79,83.87 25.15,83.87 26.01,84.73 ENCODER2.3
ROT3A
  Top 0.254: DI_R1.P$4 8.55,74.28 DI_IC1.4 8.53,79.58 8.53,80.37 8.84,80.67 24.18,80.67 26.01,78.84 ENCODER3.4
ROT3B
  Top 0.254: DI_IC1.3 7.28,79.05 | 7.28,79.05 7.28,74.67 DI_R1.P$5 | ENCODER3.3 27.23,77.47 27.23,79.86 25.91,81.18 7.82,81.18 7.28,80.63 7.28,79.05
ROT4A
  Top 0.254: ENCODER4.4 26.01,70.61 24.99,71.63 14.83,71.63 14.02,72.44 14.02,73.79 DI_R1.P$2 14.07,75.03 13.51,75.59 10.87,75.59 10.36,76.1 10.36,78.23 11.07,78.94 DI_IC1.6
ROT4B
  Top 0.254: DI_IC1.5 9.82,75.55 DI_R1.P$3 11.48,73.79 11.48,72.44 12.8,71.12 23.98,71.12 24.69,70.41 24.69,68.17 25.96,66.9 ENCODER4.3
ROT5A
  Top 0.254: DI_IC2.12 11.21,52.8 DI_R4.P$4 11.58,53.17 11.58,54.56 13,55.98 24.18,55.98 24.69,56.49 24.69,58.93 25.86,60.1 ENCODER5.4
ROT5B
  Top 0.254: DI_IC2.11 12.48,49.47 14.12,51.1 14.12,53.06 DI_R4.P$5 14.12,53.17 14.12,54.56 14.83,55.27 25.4,55.27 26.01,55.88 ENCODER5.3
ROT6A
  Top 0.254: DI_R4.P$2 6.6,52.96 6.6,52.53 8.67,50.46 DI_IC2.14 8.64,47.01 8.64,46.23 9.55,45.31 25.6,45.31 27.23,46.94 27.23,49.48 26.01,50.7 ENCODER6.4
ROT6B
  Top 0.254: DI_R4.P$3 9.94,52.16 DI_IC2.13 9.94,46.34 9.96,46.33 10.46,45.82 24.99,45.82 26.01,46.84 ENCODER6.3
ROT7A
  Top 0.254: DI_R3.P$4 9.94,37.07 DI_IC2.4 9.94,42.45 10.67,43.18 24.23,43.18 ENCODER7.4
ROT7B
  Top 0.254: DI_R3.P$5 6.91,36.58 6.91,37.08 8.67,38.85 DI_IC2.3 8.67,42.2 10.16,43.69 25.81,43.69 27.33,42.16 27.33,40.18 ENCODER7.3
ROT8A
  Top 0.254: DI_IC2.6 12.48,39.84 14.12,38.2 14.12,36.26 DI_R3.P$2 14.17,34.89 14.12,34.85 14.12,34.65 14.83,33.93 25.4,33.93 26.01,33.33 ENCODER8.4
ROT8B
  Top 0.254: DI_IC2.5 11.21,36.63 DI_R3.P$3 11.63,35.62 14.02,33.22 23.98,33.22 24.79,32.41 24.79,30.73 ENCODER8.3
ROW1
  Bottom 0.254: MX_R1.9 36.15,29.5 ENCODER8.11 34.75,30.94 34.75,37.39 36.17,38.81 ENCODER7.11 34.75,40.28 34.75,46.74 36.17,48.16 ENCODER6.11 34.75,49.63 34.75,56.19 36.12,57.56 ENCODER5.11 34.75,58.98 34.75,65.43 36.17,66.85 ENCODER4.11 34.75,68.33 34.75,74.88 36.12,76.25 ENCODER3.11 34.75,77.67 34.75,84.23 36.12,85.6 ENCODER2.11 34.75,87.02 34.75,93.57 36.12,94.94 ENCODER1.11
ROW2
  Bottom 0.254: MX_R1.10 37.42,29.84 36.17,31.09 ENCODER8.12 36.78,32.66 36.78,37.8 37.39,38.41 37.39,39.32 36.17,40.54 ENCODER7.12 36.78,42.01 36.78,47.14 37.39,47.75 37.39,48.67 36.17,49.89 ENCODER6.12 36.78,51.36 36.78,56.39 37.39,57 37.39,58.12 36.17,59.33 ENCODER5.12 36.78,60.71 36.78,65.84 37.39,66.45 37.39,67.46 36.17,68.68 ENCODER4.12 36.78,70.05 36.78,75.18 37.39,75.79 37.39,76.61 36.17,77.83 ENCODER3.12 36.78,79.4 36.78,84.53 37.39,85.14 37.39,85.95 36.17,87.17 ENCODER2.12 36.78,88.75 36.78,93.88 37.39,94.49 37.39,95.3 36.17,96.52 ENCODER1.12
ROW3
  Bottom 0.254: MX_R1.11 38.69,29.5 ENCODER8.13 37.29,30.94 37.29,37.49 38.66,38.86 ENCODER7.13 37.29,40.28 37.29,46.74 38.71,48.16 ENCODER6.13 37.29,49.63 37.29,56.08 38.71,57.51 ENCODER5.13 37.29,58.98 37.29,65.53 38.66,66.9 ENCODER4.13 37.29,68.33 37.29,74.88 38.66,76.25 ENCODER3.13 37.29,77.67 37.29,84.12 38.71,85.55 ENCODER2.13 37.29,87.02 37.29,93.47 38.71,94.89 ENCODER1.13
ROW4
  Bottom 0.254: MX_R1.12 39.96,29.84 38.71,31.09 ENCODER8.14 39.32,32.66 39.32,37.8 39.93,38.41 39.93,39.32 38.71,40.54 ENCODER7.14 39.32,42.01 39.32,47.14 39.93,47.75 39.93,48.67 38.71,49.89 ENCODER6.14 39.32,51.36 39.32,56.49 39.93,57.1 39.93,58.12 38.71,59.33 ENCODER5.14 39.32,60.71 39.32,65.84 39.93,66.45 39.93,67.36 38.71,68.58 ENCODER4.14 39.32,70.05 39.32,75.29 39.93,75.89 39.93,76.61 38.71,77.83 ENCODER3.14 39.32,79.4 39.32,84.53 39.93,85.14 39.93,85.95 38.71,87.17 ENCODER2.14 39.32,88.75 39.32,93.88 39.93,94.49 39.93,95.3 38.71,96.52 ENCODER1.14
ROW5
  Bottom 0.254: MX_R1.13 41.23,29.5 ENCODER8.15 39.83,30.94 39.83,37.49 41.2,38.86 ENCODER7.15 39.83,40.28 39.83,46.84 41.2,48.21 ENCODER6.15 39.83,49.63 39.83,56.19 41.2,57.56 ENCODER5.15 39.83,58.98 39.83,65.43 41.25,66.85 ENCODER4.15 39.83,68.33 39.83,74.98 41.2,76.25 ENCODER3.15 39.83,77.67 39.83,84.23 41.2,85.6 ENCODER2.15 39.83,87.02 39.83,93.47 41.25,94.89 ENCODER1.15
ROW6
  Bottom 0.254: MX_R1.14 42.5,29.84 41.35,30.99 41.35,31.95 ENCODER8.16 41.86,32.66 41.86,37.8 42.47,38.41 42.47,39.22 42.47,39.32 41.25,40.54 ENCODER7.16 41.86,42.01 41.86,47.14 42.47,47.75 42.47,48.67 41.25,49.89 ENCODER6.16 41.86,51.36 41.86,56.49 42.47,57.1 42.47,58.01 41.25,59.23 ENCODER5.16 41.86,60.71 41.86,65.73 42.47,66.34 42.47,67.36 41.25,68.58 ENCODER4.16 41.86,70.05 41.86,75.18 42.37,75.69 42.37,76.71 41.25,77.83 ENCODER3.16 41.86,79.4 41.86,84.53 42.47,85.14 42.47,85.95 41.25,87.17 ENCODER2.16 41.86,88.75 41.86,93.88 42.47,94.49 42.47,95.4 41.25,96.62 ENCODER1.16
ROW7
  Bottom 0.254: MX_R1.15 43.77,29.5 ENCODER8.17 42.37,30.94 42.37,37.39 43.79,38.81 ENCODER7.17 42.37,40.28 42.37,46.74 43.79,48.16 ENCODER6.17 42.37,49.63 42.37,56.08 43.79,57.51 ENCODER5.17 42.37,58.98 42.37,65.43 43.79,66.85 ENCODER4.17 42.37,68.33 42.37,74.88 43.74,76.25 ENCODER3.17 42.37,77.67 42.37,84.02 43.79,85.45 ENCODER2.17 42.37,87.02 42.37,93.57 43.74,94.94 ENCODER1.17
ROW8
  Bottom 0.254: MX_R1.16 45.04,29.84 43.79,31.09 43.79,31.29 ENCODER8.18 44.4,32.66 44.4,37.9 44.91,38.41 44.91,39.42 43.79,40.54 ENCODER7.18 44.4,42.01 44.4,47.14 45.01,47.75 45.01,48.67 43.79,49.89 ENCODER6.18 44.4,51.36 44.4,56.49 45.01,57.1 45.01,58.01 43.79,59.23 ENCODER5.18 44.4,60.71 44.4,65.84 45.01,66.45 45.01,67.26 43.79,68.48 ENCODER4.18 44.4,70.05 44.4,75.18 45.01,75.79 45.01,76.71 43.79,77.93 ENCODER3.18 44.4,79.4 44.4,84.63 44.91,85.14 44.91,86.06 43.79,87.17 ENCODER2.18 44.4,88.75 44.4,93.88 45.01,94.49 45.01,95.5 43.79,96.72 ENCODER1.18
ROW9
  Bottom 0.254: MX_R2.9 46.86,28.98 ENCODER8.19 44.91,30.94 44.91,37.39 46.33,38.81 ENCODER7.19 44.91,40.28 44.91,46.84 46.28,48.21 ENCODER6.19 44.91,49.63 44.91,56.19 46.28,57.56 ENCODER5.19 44.91,58.98 44.91,65.53 46.28,66.9 ENCODER4.19 44.91,68.33 44.91,74.88 46.28,76.25 ENCODER3.19 44.91,77.67 44.91,84.23 46.28,85.6 ENCODER2.19 44.91,87.02 44.91,93.47 46.33,94.89 ENCODER1.19
ROW10
  Bottom 0.254: MX_R2.10 48.13,28.27 47.65,28.75 47.65,29.97 46.74,30.89 46.74,31.65 ENCODER8.20 47.04,32.77 47.04,37.9 47.55,38.41 47.55,39.22 46.33,40.44 ENCODER7.20 46.94,42.01 46.94,47.14 47.55,47.75 47.55,48.67 46.33,49.89 ENCODER6.20 46.94,51.36 46.94,56.49 47.55,57.1 47.55,58.01 46.33,59.23 ENCODER5.20 46.94,60.71 46.94,65.84 47.55,66.45 47.55,67.46 46.33,68.68 ENCODER4.20 46.94,70.05 46.94,75.18 47.55,75.79 47.55,76.61 46.33,77.83 ENCODER3.20 46.94,79.4 46.94,84.63 47.55,85.24 47.55,85.95 46.33,87.17 ENCODER2.20 46.94,88.75 46.94,93.88 47.55,94.49 47.55,95.4 46.33,96.62 ENCODER1.20
ROW11
  Bottom 0.254: MX_R2.11 49.4,28.98 ENCODER8.21 48.87,30.07 47.55,31.39 47.55,37.59 48.82,38.86 ENCODER7.21 47.45,40.28 47.45,46.84 48.82,48.21 ENCODER6.21 47.45,49.63 47.45,56.19 48.82,57.56 ENCODER5.21 47.45,58.98 47.45,65.43 48.87,66.85 ENCODER4.21 47.45,68.33 47.45,74.78 48.87,76.2 ENCODER3.21 47.45,77.67 47.45,84.23 48.82,85.6 ENCODER2.21 47.45,87.02 47.45,93.47 48.87,94.89 ENCODER1.21
ROW12
  Bottom 0.254: MX_R2.12 50.67,28.27 50.19,28.75 50.19,29.97 49.28,30.89 49.28,31.65 ENCODER8.22 49.68,32.87 49.68,38 50.09,38.41 50.09,39.32 48.87,40.54 ENCODER7.22 49.68,42.22 49.68,47.35 50.09,47.75 50.09,48.67 48.87,49.89 ENCODER6.22 49.48,51.36 49.48,56.49 50.09,57.1 50.09,58.01 48.87,59.23 ENCODER5.22 49.48,60.71 49.48,65.84 50.09,66.45 50.09,67.36 48.87,68.58 ENCODER4.22 49.48,70.05 49.48,75.18 49.99,75.69 49.99,76.71 48.87,77.83 ENCODER3.22 49.48,79.4 49.48,84.63 49.99,85.14 49.99,86.26 48.87,87.38 ENCODER2.22 49.48,88.75 49.48,93.88 49.99,94.39 49.99,95.4 48.87,96.52 ENCODER1.22
ROW13
  Bottom 0.254: MX_R2.13 51.94,28.98 ENCODER8.23 51.41,30.07 50.19,31.29 50.19,37.59 51.41,38.81 ENCODER7.23 50.19,40.08 50.19,47.04 51.36,48.21 ENCODER6.23 49.99,49.63 49.99,56.08 51.41,57.51 ENCODER5.23 49.99,58.98 49.99,65.53 51.36,66.9 ENCODER4.23 49.99,68.33 49.99,74.88 51.36,76.25 ENCODER3.23 49.99,77.67 49.99,84.23 51.36,85.6 ENCODER2.23 49.99,87.02 49.99,93.57 51.36,94.94 ENCODER1.23
ROW14
  Bottom 0.254: MX_R2.14 53.21,28.27 52.73,28.75 52.73,30.07 51.82,30.99 51.82,31.65 ENCODER8.24 52.22,32.87 52.22,38 52.63,38.41 52.63,39.22 51.41,40.44 ENCODER7.24 52.22,42.22 52.22,47.35 52.63,47.75 52.63,48.67 51.41,49.89 ENCODER6.24 52.02,51.36 52.02,56.49 52.63,57.1 52.63,58.01 51.41,59.23 ENCODER5.24 52.02,60.71 52.02,65.94 52.53,66.45 52.53,67.36 51.41,68.48 ENCODER4.24 52.02,70.05 52.02,75.18 52.63,75.79 52.63,76.71 51.41,77.93 ENCODER3.24 52.02,79.4 52.02,84.53 52.63,85.14 52.63,85.95 51.41,87.17 ENCODER2.24 52.02,88.75 52.02,93.98 52.63,94.59 52.63,95.2 52.63,95.4 51.41,96.62 ENCODER1.24
ROW15
  Bottom 0.254: MX_R2.15 54.48,28.98 ENCODER8.25 53.95,29.97 52.73,31.19 52.73,37.59 52.73,37.64 ENCODER7.25 52.73,40.08 52.73,47.04 53.9,48.21 ENCODER6.25 52.53,49.63 52.53,56.19 53.9,57.56 ENCODER5.25 52.53,58.98 52.53,65.53 53.9,66.9 ENCODER4.25 52.53,68.33 52.53,74.78 53.95,76.2 ENCODER3.25 52.53,77.67 52.53,84.12 53.95,85.55 ENCODER2.25 52.53,87.02 52.53,93.47 53.95,94.89 ENCODER1.25
ROW16
  Bottom 0.254: MX_R2.16 55.78,20.03 55.78,20.93 55.17,21.54 55.17,30.79 53.95,32 ENCODER8.26 53.24,32.77 53.24,36.47 55.17,38.41 55.17,40.13 53.95,41.35 ENCODER7.26 53.24,42.11 53.24,45.82 55.17,47.75 55.17,49.48 53.95,50.7 ENCODER6.26 53.14,51.56 53.14,55.07 55.17,57.1 55.17,58.83 53.95,60.05 ENCODER5.26 53.14,60.91 53.14,64.41 55.27,66.55 55.27,68.17 54,69.44 ENCODER4.26 53.04,70.36 53.04,73.76 53.14,73.86 55.17,75.89 55.17,77.62 54,78.79 ENCODER3.26 53.95,78.94 53.04,79.86 53.04,83.01 55.07,85.04 55.07,87.02 ENCODER2.26 53.95,88.29 53.04,89.2 53.04,92.35 55.17,94.49 55.17,96.27 ENCODER1.26
SC  (via drill 0.33)
  Top 0.254: v33.43,132.08 26.42,125.07 14.43,125.07 13.11,123.75 13.11,119.18 14.53,117.75 v20.12,117.75 | DI_IC3.2 13.06,105.66 13.72,105.66 v14.43,105.66 | v17.88,69.7 v5.99,69.7 | v5.99,76.2 6.01,77.3 DI_IC1.2 | v15.95,12.7 18.8,12.7 22.25,16.15 24.49,16.15 v26.31,17.98 | v15.85,104.24 19.81,108.2 v22.35,108.2 | v39.83,17.27 39.83,17.78 38.3,19.3 37.51,19.3 DO_IC7.11 | v7.62,44.5 7.4,44.18 DI_IC2.2 7.4,44.28 v7.62,44.5
  Bottom 0.254: v33.43,132.08 35.89,132.08 DO_IC4_R.13 36.04,132.08 38,132.08 40.03,132.08 41.35,130.76 44.77,130.76 J1.8 J1.7 | v20.12,117.75 21.9,115.97 DO_IC5_G.13 21.8,108.75 v22.35,108.2 | v15.85,104.24 v14.43,105.66 v15.85,104.24 | v15.85,104.24 17.07,103.02 17.07,83.62 18.29,82.4 18.29,80.47 17.88,80.06 v17.88,69.7 | v5.99,76.2 5.99,69.9 v5.99,69.7 7.62,68.07 v7.62,44.5 7.62,14.02 8.94,12.7 9.98,12.7 DO_IC6_B.13 14.4,12.73 v15.95,12.7 15.95,11.28 18.29,8.94 24.89,8.94 27.13,11.18 34.44,11.18 35.05,11.79 35.8,11.79 | v26.31,17.98 25.62,18.69 DO_IC8.11 | 35.8,11.79 DO_IC9.11 35.9,11.68 38,11.68 38,9.96 39.73,8.23 42.16,8.23 42.88,8.94 49.68,8.94 50.09,8.94 51.31,7.77 J2.8 J2.7 | 35.8,11.79 38,11.79 39.83,13.61 v39.83,17.27
SI-INPUT  (via drill 0.33)
  Top 0.254: DI_R6.P$1 32.83,117.25 30.38,117.25 29.16,116.03 10.77,116.03 | 10.77,116.03 8.74,114 8.74,112.67 8.04,111.95 DI_IC3.10 | v6.91,121.41 7.32,121.41 10.77,118.16 10.77,116.03
  Bottom 0.254: v6.91,121.41 3.25,121.41 2.74,120.9 2.74,95.81 5.08,93.47 5.08,86.77 5.59,86.26 5.59,77.32 5.18,76.91 5.18,33.63 6.2,32.61 6.2,11.18 14.43,2.95 47.45,2.95 48.77,4.27 48.77,5.15 J2.5
SI-OUTPUT  (via drill 0.33)
  Top 0.254: 18.19,136.14 16.97,136.14 | 16.97,136.14 4.67,123.85 v4.67,110.03 | v11.18,87.88 12.4,87.27 13.21,87.27 13.61,86.87 13.61,85.74 13.63,85.74 DI_IC1.9 | J1.5 48.83,134.68 47.75,133.6 41.45,133.6 38.91,136.14 18.19,136.14 | 18.19,136.14 16.97,136.14
  Bottom 0.254: v4.67,110.03 3.86,108.51 3.86,103.94 4.67,103.12 4.67,96.01 11.18,89.51 v11.18,87.88
SO-INPUT  (via drill 0.33)
  Top 0.254: v23.67,131.06 23.67,135.03 24.28,135.64 25.3,135.64 36.88,135.64 42.37,130.15 46.63,130.15 48.76,132.28 J1.6
  Bottom 0.254: v23.67,131.06 23.67,126.09 24.1,125.66 DO_IC4_R.3
SO-OUTPUT
  Bottom 0.254: DO_IC9.9 35.84,7.64 39.62,3.86 46.84,3.86 46.94,3.86 47.55,4.47 47.55,6.47 J2.6
SW1
  Top 0.254: DI_IC3B.8 29.36,102.31 29.36,101.4 31.09,99.67 ENCODER1.8
SW2
  Top 0.254: DI_IC3B.7 28.14,102.26 28.14,101.3 29.87,99.57 29.87,90.63 31.09,89.41 ENCODER2.8
SW3
  Top 0.254: DI_IC3B.6 26.82,102.31 26.82,101.4 27.33,100.89 27.33,93.57 27.33,92.66 27.33,92.46 27.33,92.25 29.87,89.71 29.87,82.19 31.09,80.97 ENCODER3.8
SW4  (via drill 0.33)
  Top 0.254: DI_IC3B.5 25.5,101.3 v26.42,100.38
  Bottom 0.254: v26.42,100.38 27.33,99.47 27.33,84.23 27.33,82.6 29.87,80.06 29.87,72.14 31.09,70.92 ENCODER4.8
SW5  (via drill 0.33)
  Top 0.254: DI_IC3B.4 24.28,102.31 24.28,101.3 24.79,100.79 v24.79,99.47
  Bottom 0.254: v24.79,99.47 24.89,99.36 24.79,65.43 28.24,61.98 29.26,61.98 31.09,60.15 ENCODER5.8
SW6  (via drill 0.33)
  Top 0.254: DI_IC3B.3 23.06,102.26 v23.06,100.38 | v20.73,54.05 21.23,53.54 29.26,53.54 31.09,51.71 ENCODER6.8
  Bottom 0.254: v23.06,100.38 23.06,99.47 21.03,97.43 21.03,54.36 v20.73,54.05
SW7  (via drill 0.33)
  Top 0.254: DI_IC3B.2 21.74,102.31 21.74,101.4 v21.74,99.47 | v20.73,44.5 29.36,44.5 31.09,42.77 ENCODER7.8
  Bottom 0.254: v21.74,99.47 20.52,98.25 20.52,55.17 19.91,54.56 19.91,53.34 19.91,53.24 20.73,52.43 20.73,45.72 v20.73,44.5
SW8  (via drill 0.33)
  Top 0.254: DI_IC3B.1 v20.42,100.48 | v20.22,36.27 21.13,35.36 29.77,35.36 31.09,34.04 ENCODER8.8
  Bottom 0.254: v20.42,100.48 20.02,100.08 20.02,55.47 19.41,54.86 19.41,52.73 19.81,52.32 19.81,36.68 v20.22,36.27

## Text on the board
tNames: Encoder 1-8 -> | 1 | 2 | 3 | 4 | 5 | 6 | 7 | 8
bNames: GND | 5V | SI | SC | RC-I | J2 | GND | 5V | SO | SC | RC-O | GND | A | Gr | SW | SEL | 2 | 4 | 6 | 8 | 10 | 12 | 14 | 16 | Encoder 1 | 5V | B | Bl | Red | 1 | 3 | 5 | 7 | 9 | 11 | 13 | 15 | GND | A | Gr | SW | SEL | 2 | 4 | 6 | 8 | 10 | 12 | 14 | 16 | Encoder 2 | 5V | B | Bl | Red | 1 | 3 | 5 | 7 | 9 | 11 | 13 | 15 | GND | A | Gr | SW | SEL | 2 | 4 | 6 | 8 | 10 | 12 | 14 | 16 | Encoder 3 | 5V | B | Bl | Red | 1 | 3 | 5 | 7 | 9 | 11 | 13 | 15 | GND | A | Gr | SW | SEL | 2 | 4 | 6 | 8 | 10 | 12 | 14 | 16 | Encoder 4 | 5V | B | Bl | Red | 1 | 3 | 5 | 7 | 9 | 11 | 13 | 15 | GND | A | Gr | SW | SEL | 2 | 4 | 6 | 8 | 10 | 12 | 14 | 16 | Encoder 5 | 5V | B | Bl | Red | 1 | 3 | 5 | 7 | 9 | 11 | 13 | 15 | GND | A | Gr | SW | SEL | 2 | 4 | 6 | 8 | 10 | 12 | 14 | 16 | Encoder 6 | 5V | B | Bl | Red | 1 | 3 | 5 | 7 | 9 | 11 | 13 | 15 | GND | A | Gr | SW | SEL | 2 | 4 | 6 | 8 | 10 | 12 | 14 | 16 | Encoder 7 | 5V | B | Bl | Red | 1 | 3 | 5 | 7 | 9 | 11 | 13 | 15 | Encoder 8 | GND | A | Gr | SW | SEL | 2 | 4 | 6 | 8 | 10 | 12 | 14 | 16 | 5V | B | Bl | Red | 1 | 3 | 5 | 7 | 9 | 11 | 13 | 15 | GND | 5V | SO | SC | RC-O | J2 | GND | 5V | SI | SC | RC-I